# Altium project LimeSDR-QPCIe_1v2.PrjPcb (part 1 of 13)
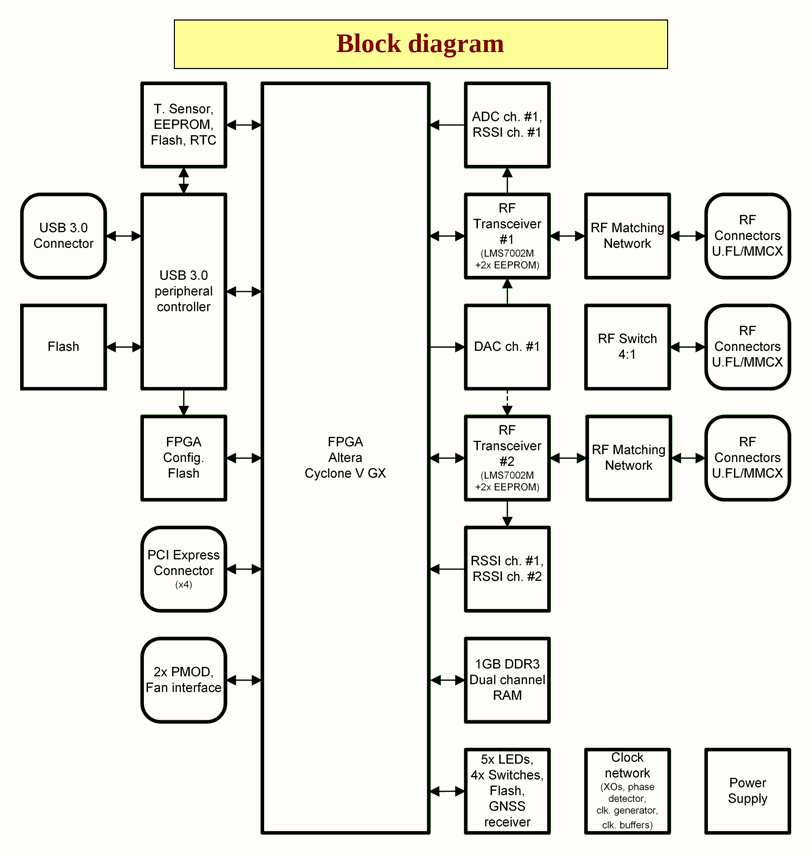
[diagram p0: 01_BlockDiagram.SchDoc]
29 sheets, 2027 parts. Net scope: global (net labels, ports and power ports of the same name join across sheets).
Board file: LimeSDR-QPCIe_1v2.PcbDoc
Sheets:
  01_BlockDiagram.SchDoc
  02_PowerDiagram.SchDoc
  03_ClockDiagram.SchDoc
  04_LMS7002M_Digital.SchDoc
  05_LMS7002M_1_RF.SchDoc
  06_LMS7002M_2_RF.SchDoc
  07_LMS7002M_1_Power.SchDoc
  08_LMS7002M_2_Power.SchDoc
  09_RF_Loopback.SchDoc
  10_RSSI1.SchDoc
  11_RSSI2.SchDoc
  12_FPGA_banks_3A_3B_4A.SchDoc
  13_FPGA_banks_5A_5B_6A.SchDoc
  14_FPGA_banks_7A_8A.SchDoc
  15_FPGA_misc_banks.SchDoc
  16_FPGA_pwr_banks.SchDoc
  17_FPGA_decoupling.SchDoc
  18_DDR3_TOP.SchDoc
  19_DDR3_BOT.SchDoc
  20_ADC.SchDoc
  21_DAC.SchDoc
  22_USB3_0_device.SchDoc
  23_PCIe.SchDoc
  24_Peripherals.SchDoc
  25_Clocks_1.SchDoc
  26_Clocks_2.SchDoc
  27_BoardPowerSupply 1.SchDoc
  28_BoardPowerSupply 2.SchDoc
  29_LMS7002M_PowerSupply.SchDoc

## Sheet 01_BlockDiagram.SchDoc: Block diagram
size A4; Organization: Lime Microsystems; Address1: Surrey Tech Centre; Address2: Guildford GU2 7YG; Address3: Surrey; Address4: United Kingdom; Revision: v1.2; SheetNumber: 1; SheetTotal: 27

### Notes on the sheet
- Block diagram
- Project name:
- Title:
- Size:
- Date:
- A4
- Revision:
- Time:
- Sheet
- of
- File:

## Sheet 02_PowerDiagram.SchDoc: Power diagram
size A4; Organization: Lime Microsystems; Address1: Surrey Tech Centre; Address2: Guildford GU2 7YG; Address3: Surrey; Address4: United Kingdom; Revision: v1.2; SheetNumber: 2; SheetTotal: 27
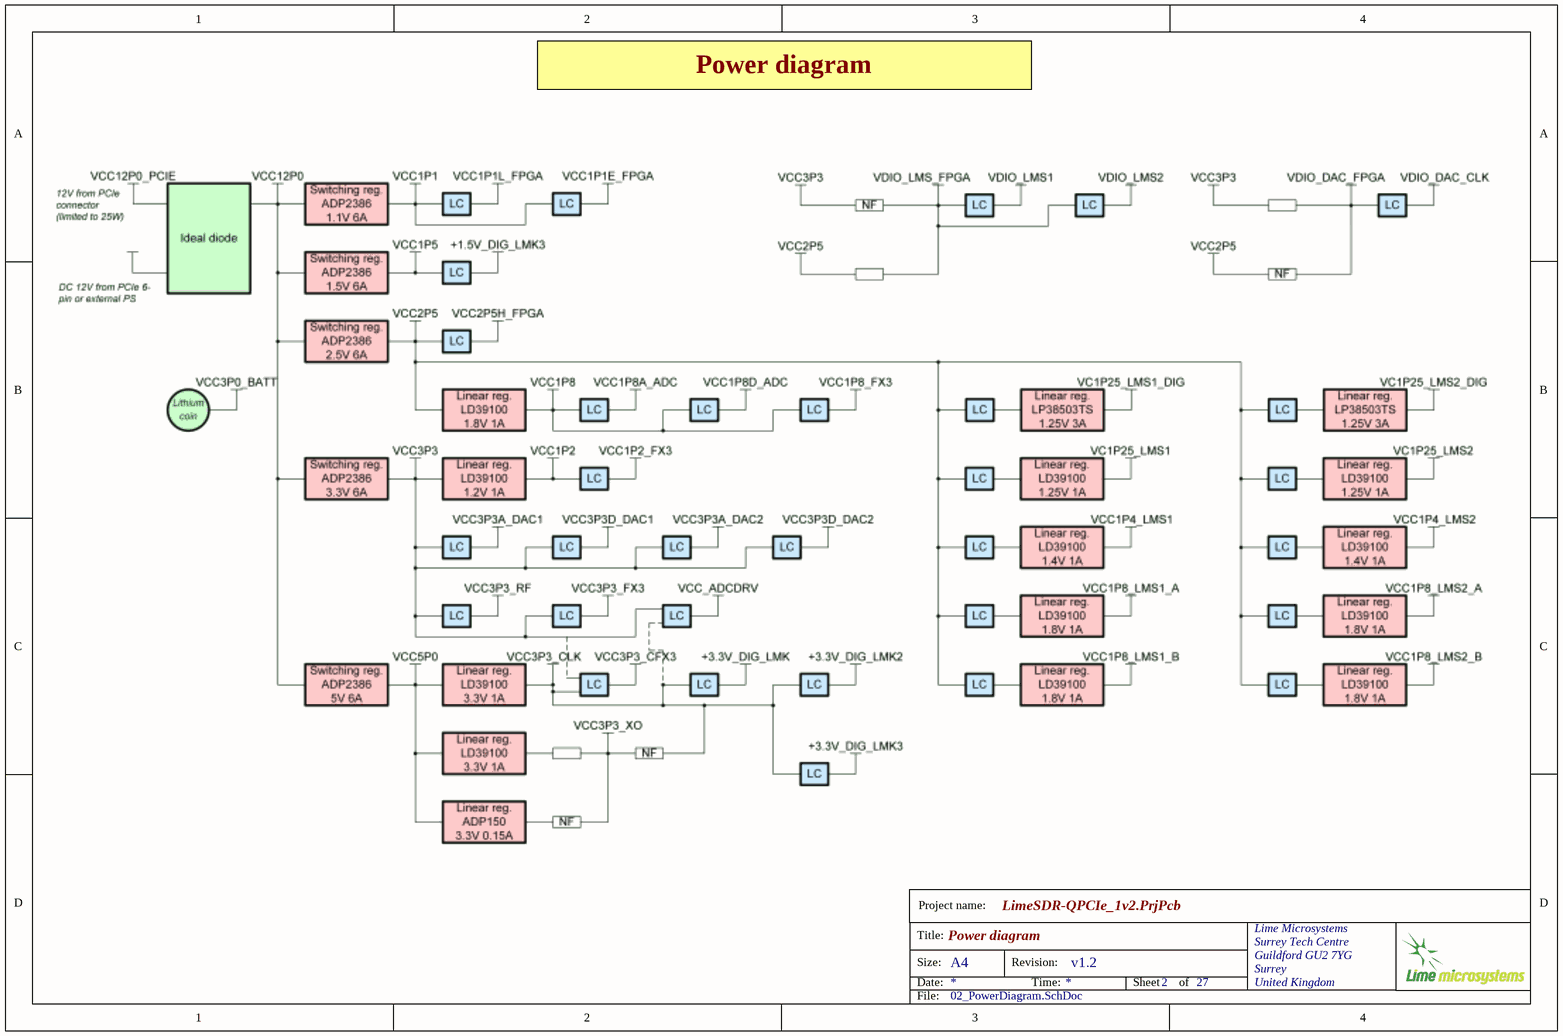
[diagram p1: 02_PowerDiagram.SchDoc]

### Notes on the sheet
- Power diagram
- Project name:
- Title:
- Size:
- Date:
- A4
- Revision:
- Time:
- Sheet
- of
- File:

## Sheet 03_ClockDiagram.SchDoc: Clock diagram
size A4; Organization: Lime Microsystems; Address1: Surrey Tech Centre; Address2: Guildford GU2 7YG; Address3: Surrey; Address4: United Kingdom; Revision: v1.2; SheetNumber: 3; SheetTotal: 27
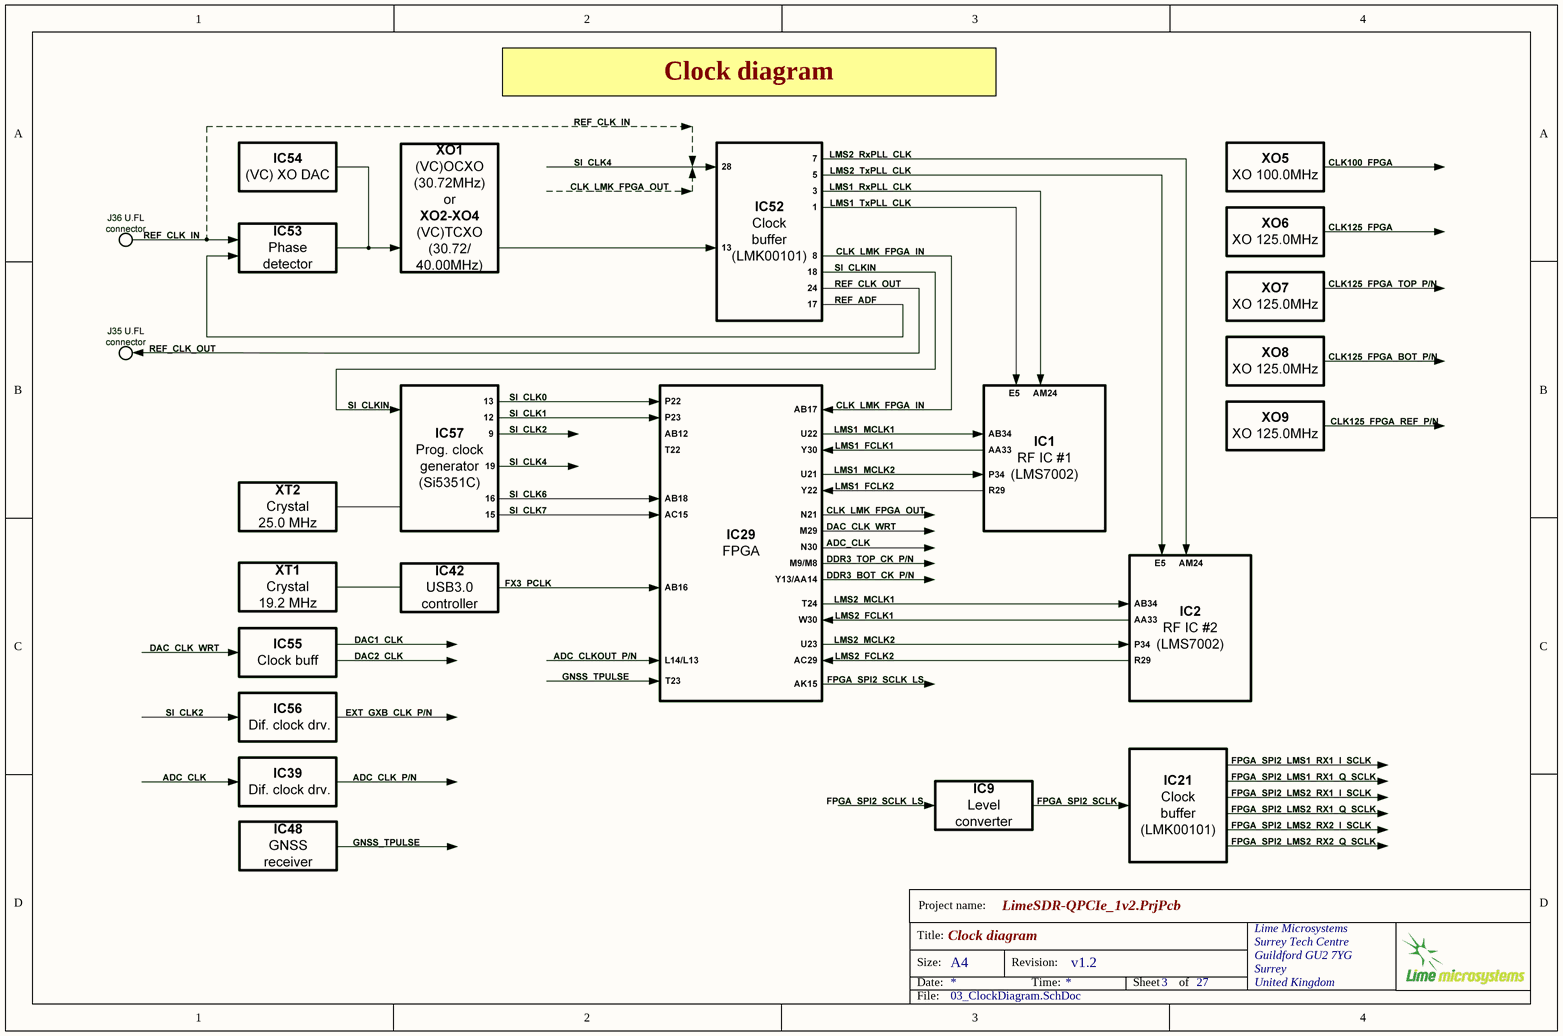
[diagram p2: 03_ClockDiagram.SchDoc]

### Notes on the sheet
- Clock diagram
- Project name:
- Title:
- Size:
- Date:
- A4
- Revision:
- Time:
- Sheet
- of
- File:

## Sheet 04_LMS7002M_Digital.SchDoc: LMS7002M #1 digital circuit
size A3; Organization: Lime Microsystems; Address1: Surrey Tech Centre; Address2: Guildford GU2 7YG; Address3: Surrey; Address4: United Kingdom; Revision: v1.2; SheetNumber: 4; SheetTotal: 27
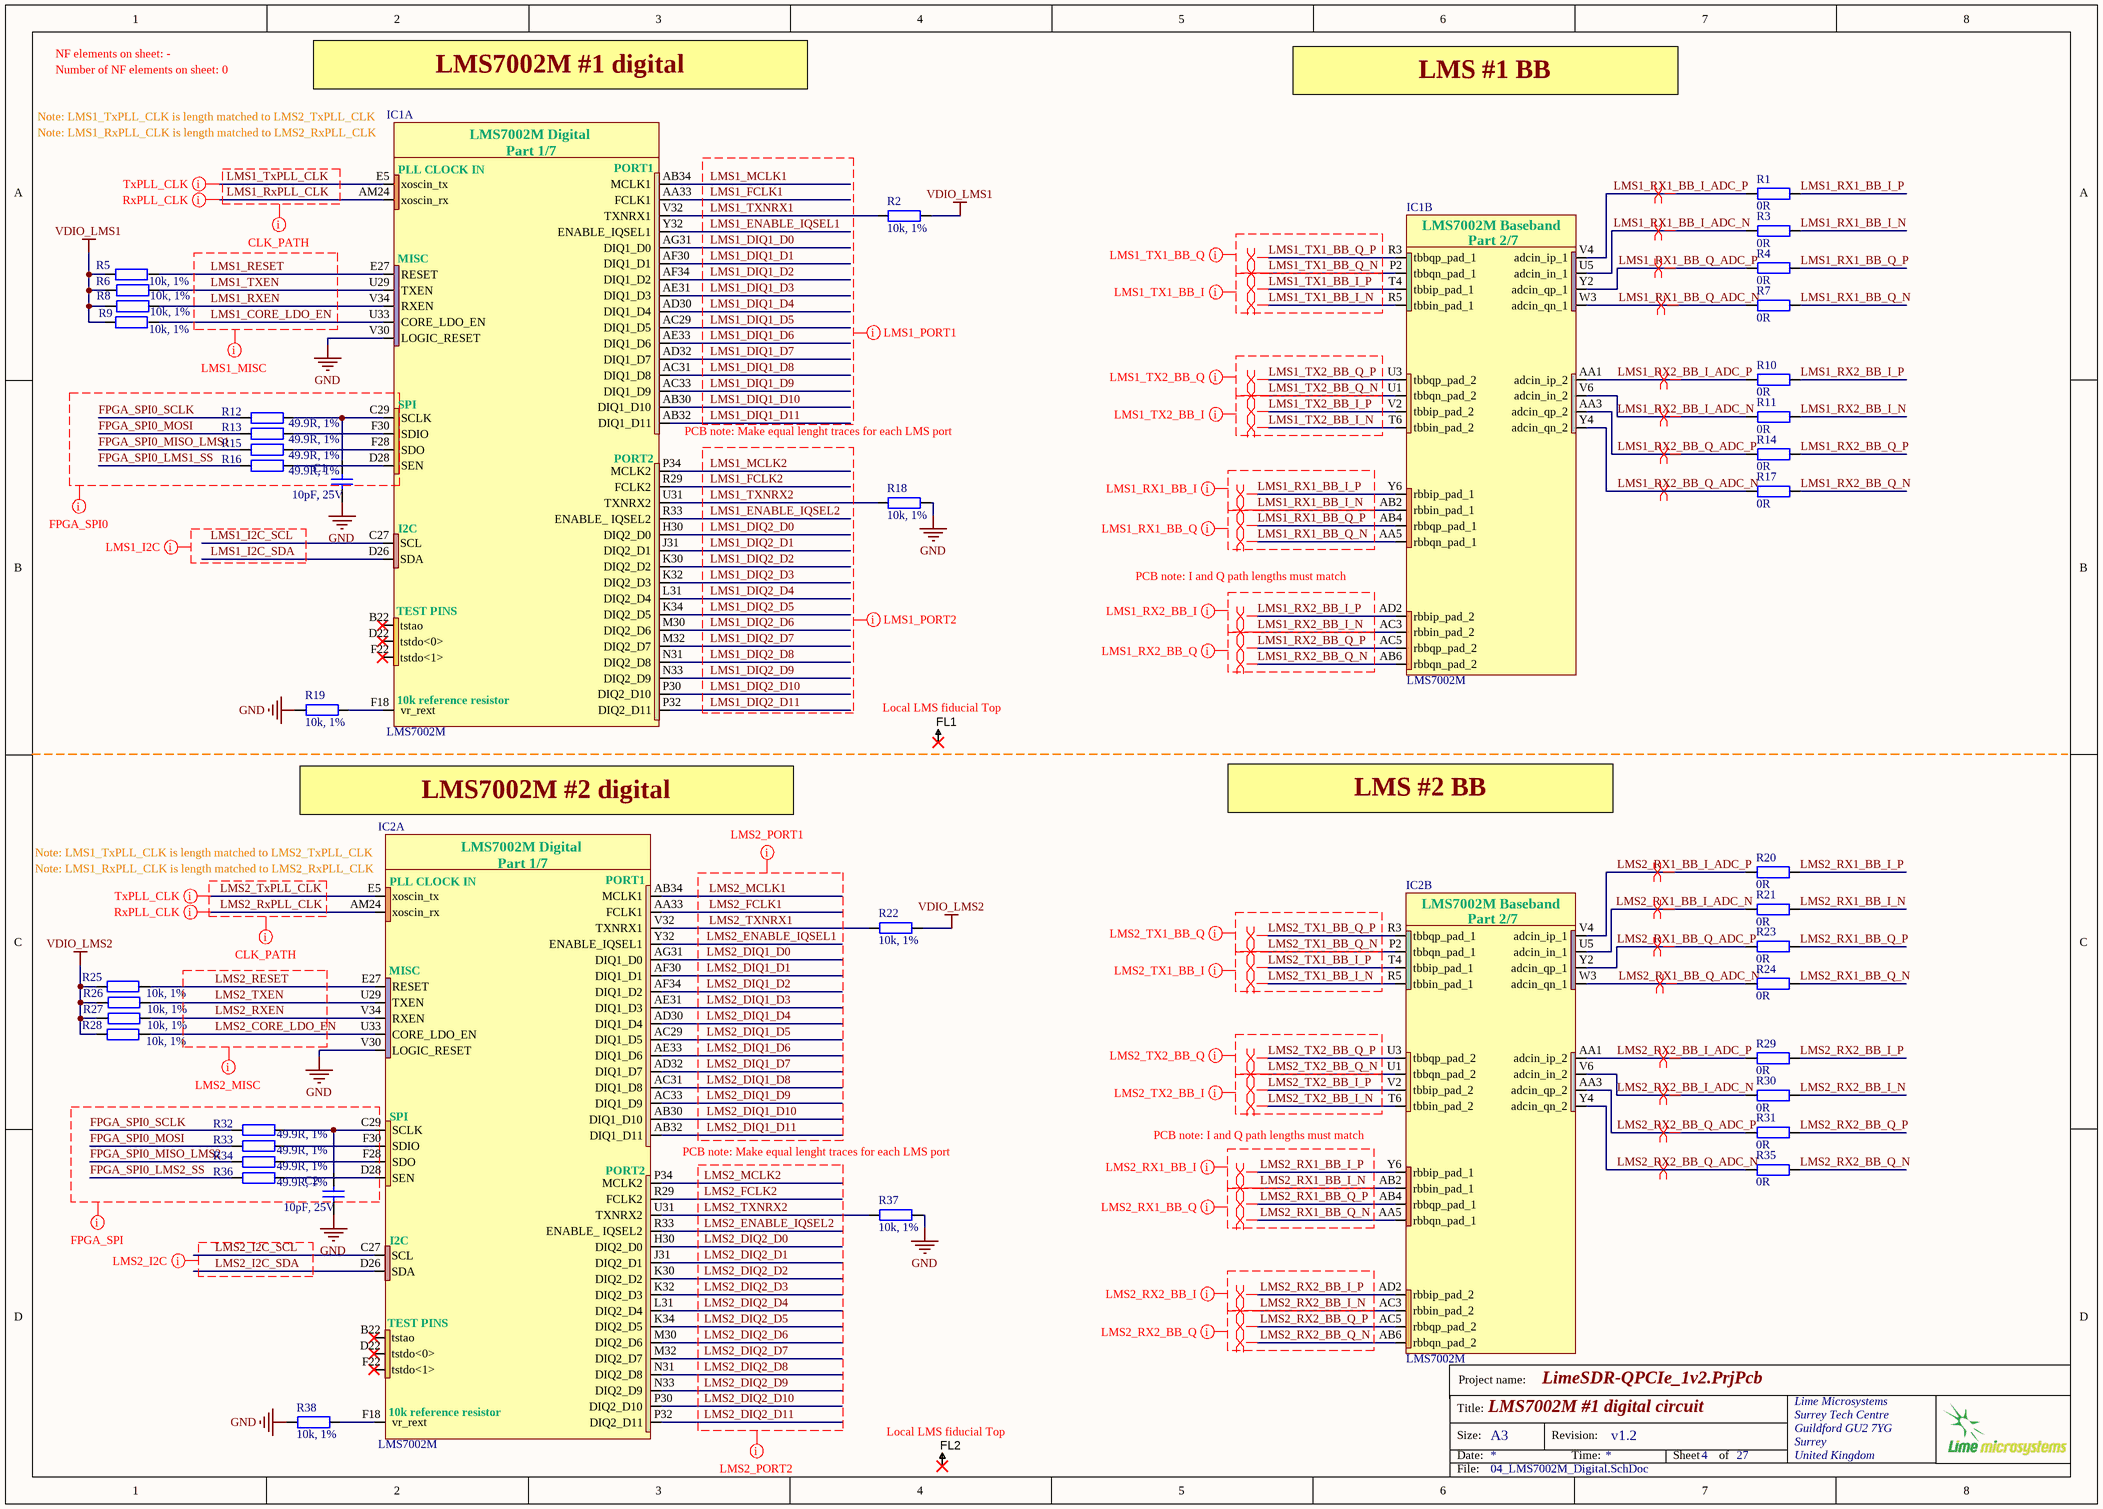
[diagram p3: 04_LMS7002M_Digital.SchDoc]

### Parts
C1  10pF, 25V  [CAP0402]
C2  10pF, 25V  [CAP0402]
FL1  Fiducial  [Fiducial_local]  (value not drawn)
FL2  Fiducial  [Fiducial_local]  (value not drawn)
IC1  LMS7002M  [LMS7002M_v4]  (parts A,B of 7)
IC2  LMS7002M  [LMS7002M_v4]  (parts A,B of 7)
R1  0R  [RES0402]
R2  10k, 1%  [RES0402]
R3  0R  [RES0402]
R4  0R  [RES0402]
R5  10k, 1%  [RES0402]
R6  10k, 1%  [RES0402]
R7  0R  [RES0402]
R8  10k, 1%  [RES0402]
R9  10k, 1%  [RES0402]
R10  0R  [RES0402]
R11  0R  [RES0402]
R12  49.9R, 1%  [RES0402]
R13  49.9R, 1%  [RES0402]
R14  0R  [RES0402]
R15  49.9R, 1%  [RES0402]
R16  49.9R, 1%  [RES0402]
R17  0R  [RES0402]
R18  10k, 1%  [RES0402]
R19  10k, 1%  [RES0402]
R20  0R  [RES0402]
R21  0R  [RES0402]
R22  10k, 1%  [RES0402]
R23  0R  [RES0402]
R24  0R  [RES0402]
R25  10k, 1%  [RES0402]
R26  10k, 1%  [RES0402]
R27  10k, 1%  [RES0402]
R28  10k, 1%  [RES0402]
R29  0R  [RES0402]
R30  0R  [RES0402]
R31  0R  [RES0402]
R32  49.9R, 1%  [RES0402]
R33  49.9R, 1%  [RES0402]
R34  49.9R, 1%  [RES0402]
R35  0R  [RES0402]
R36  49.9R, 1%  [RES0402]
R37  10k, 1%  [RES0402]
R38  10k, 1%  [RES0402]

### Nets
GND: C1.2 C2.2 IC1.V30(LOGIC_RESET) IC2.V30(LOGIC_RESET) R18.2 R19.2 R37.2 R38.2
VDIO_LMS1: R2.2 R5.1 R6.2 R8.2 R9.1
VDIO_LMS2: R22.2 R25.1 R26.2 R27.2 R28.1
FPGA_SPI0_LMS1_SS: R16.2
FPGA_SPI0_LMS2_SS: R36.2
FPGA_SPI0_MISO_LMS1: R15.2
FPGA_SPI0_MISO_LMS2: R34.2
FPGA_SPI0_MOSI: R13.2 R33.2
FPGA_SPI0_SCLK: R12.2 R32.2
LMS1_CORE_LDO_EN: IC1.U33(CORE_LDO_EN) R9.2
LMS1_DIQ1_D0: IC1.AG31(DIQ1_D0)
LMS1_DIQ1_D1: IC1.AF30(DIQ1_D1)
LMS1_DIQ1_D2: IC1.AF34(DIQ1_D2)
LMS1_DIQ1_D3: IC1.AE31(DIQ1_D3)
LMS1_DIQ1_D4: IC1.AD30(DIQ1_D4)
LMS1_DIQ1_D5: IC1.AC29(DIQ1_D5)
LMS1_DIQ1_D6: IC1.AE33(DIQ1_D6)
LMS1_DIQ1_D7: IC1.AD32(DIQ1_D7)
LMS1_DIQ1_D8: IC1.AC31(DIQ1_D8)
LMS1_DIQ1_D9: IC1.AC33(DIQ1_D9)
LMS1_DIQ1_D10: IC1.AB30(DIQ1_D10)
LMS1_DIQ1_D11: IC1.AB32(DIQ1_D11)
LMS1_DIQ2_D0: IC1.H30(DIQ2_D0)
LMS1_DIQ2_D1: IC1.J31(DIQ2_D1)
LMS1_DIQ2_D2: IC1.K30(DIQ2_D2)
LMS1_DIQ2_D3: IC1.K32(DIQ2_D3)
LMS1_DIQ2_D4: IC1.L31(DIQ2_D4)
LMS1_DIQ2_D5: IC1.K34(DIQ2_D5)
LMS1_DIQ2_D6: IC1.M30(DIQ2_D6)
LMS1_DIQ2_D7: IC1.M32(DIQ2_D7)
LMS1_DIQ2_D8: IC1.N31(DIQ2_D8)
LMS1_DIQ2_D9: IC1.N33(DIQ2_D9)
LMS1_DIQ2_D10: IC1.P30(DIQ2_D10)
LMS1_DIQ2_D11: IC1.P32(DIQ2_D11)
LMS1_ENABLE_IQSEL1: IC1.Y32(ENABLE_IQSEL1)
LMS1_ENABLE_IQSEL2: IC1.R33(ENABLE__IQSEL2)
LMS1_FCLK1: IC1.AA33(FCLK1)
LMS1_FCLK2: IC1.R29(FCLK2)
LMS1_I2C_SCL: IC1.C27(SCL)
LMS1_I2C_SDA: IC1.D26(SDA)
LMS1_MCLK1: IC1.AB34(MCLK1)
LMS1_MCLK2: IC1.P34(MCLK2)
LMS1_RESET: IC1.E27(RESET) R5.2
LMS1_RX1_BB_I_ADC_N: IC1.U5(adcin_in_1) R3.2
LMS1_RX1_BB_I_ADC_P: IC1.V4(adcin_ip_1) R1.2
LMS1_RX1_BB_I_N: IC1.AB2(rbbin_pad_1) R3.1
LMS1_RX1_BB_I_P: IC1.Y6(rbbip_pad_1) R1.1
LMS1_RX1_BB_Q_ADC_N: IC1.W3(adcin_qn_1) R7.2
LMS1_RX1_BB_Q_ADC_P: IC1.Y2(adcin_qp_1) R4.2
LMS1_RX1_BB_Q_N: IC1.AA5(rbbqn_pad_1) R7.1
LMS1_RX1_BB_Q_P: IC1.AB4(rbbqp_pad_1) R4.1
LMS1_RX2_BB_I_ADC_N: IC1.V6(adcin_in_2) R11.2
LMS1_RX2_BB_I_ADC_P: IC1.AA1(adcin_ip_2) R10.2
LMS1_RX2_BB_I_N: IC1.AC3(rbbin_pad_2) R11.1
LMS1_RX2_BB_I_P: IC1.AD2(rbbip_pad_2) R10.1
LMS1_RX2_BB_Q_ADC_N: IC1.Y4(adcin_qn_2) R17.2
LMS1_RX2_BB_Q_ADC_P: IC1.AA3(adcin_qp_2) R14.2
LMS1_RX2_BB_Q_N: IC1.AB6(rbbqn_pad_2) R17.1
LMS1_RX2_BB_Q_P: IC1.AC5(rbbqp_pad_2) R14.1
LMS1_RXEN: IC1.V34(RXEN) R6.1
LMS1_RxPLL_CLK: IC1.AM24(xoscin_rx)
LMS1_TX1_BB_I_N: IC1.R5(tbbin_pad_1)
LMS1_TX1_BB_I_P: IC1.T4(tbbip_pad_1)
LMS1_TX1_BB_Q_N: IC1.P2(tbbqn_pad_1)
LMS1_TX1_BB_Q_P: IC1.R3(tbbqp_pad_1)
LMS1_TX2_BB_I_N: IC1.T6(tbbin_pad_2)
LMS1_TX2_BB_I_P: IC1.V2(tbbip_pad_2)
LMS1_TX2_BB_Q_N: IC1.U1(tbbqn_pad_2)
LMS1_TX2_BB_Q_P: IC1.U3(tbbqp_pad_2)
LMS1_TXEN: IC1.U29(TXEN) R8.1
LMS1_TXNRX1: IC1.V32(TXNRX1) R2.1
LMS1_TXNRX2: IC1.U31(TXNRX2) R18.1
LMS1_TxPLL_CLK: IC1.E5(xoscin_tx)
LMS2_CORE_LDO_EN: IC2.U33(CORE_LDO_EN) R28.2
LMS2_DIQ1_D0: IC2.AG31(DIQ1_D0)
LMS2_DIQ1_D1: IC2.AF30(DIQ1_D1)
LMS2_DIQ1_D2: IC2.AF34(DIQ1_D2)
LMS2_DIQ1_D3: IC2.AE31(DIQ1_D3)
LMS2_DIQ1_D4: IC2.AD30(DIQ1_D4)
LMS2_DIQ1_D5: IC2.AC29(DIQ1_D5)
LMS2_DIQ1_D6: IC2.AE33(DIQ1_D6)
LMS2_DIQ1_D7: IC2.AD32(DIQ1_D7)
LMS2_DIQ1_D8: IC2.AC31(DIQ1_D8)
LMS2_DIQ1_D9: IC2.AC33(DIQ1_D9)
LMS2_DIQ1_D10: IC2.AB30(DIQ1_D10)
LMS2_DIQ1_D11: IC2.AB32(DIQ1_D11)
LMS2_DIQ2_D0: IC2.H30(DIQ2_D0)
LMS2_DIQ2_D1: IC2.J31(DIQ2_D1)
LMS2_DIQ2_D2: IC2.K30(DIQ2_D2)
LMS2_DIQ2_D3: IC2.K32(DIQ2_D3)
LMS2_DIQ2_D4: IC2.L31(DIQ2_D4)
LMS2_DIQ2_D5: IC2.K34(DIQ2_D5)
LMS2_DIQ2_D6: IC2.M30(DIQ2_D6)
LMS2_DIQ2_D7: IC2.M32(DIQ2_D7)
LMS2_DIQ2_D8: IC2.N31(DIQ2_D8)
LMS2_DIQ2_D9: IC2.N33(DIQ2_D9)
LMS2_DIQ2_D10: IC2.P30(DIQ2_D10)
LMS2_DIQ2_D11: IC2.P32(DIQ2_D11)
LMS2_ENABLE_IQSEL1: IC2.Y32(ENABLE_IQSEL1)
LMS2_ENABLE_IQSEL2: IC2.R33(ENABLE__IQSEL2)
LMS2_FCLK1: IC2.AA33(FCLK1)
LMS2_FCLK2: IC2.R29(FCLK2)
LMS2_I2C_SCL: IC2.C27(SCL)
LMS2_I2C_SDA: IC2.D26(SDA)
LMS2_MCLK1: IC2.AB34(MCLK1)
LMS2_MCLK2: IC2.P34(MCLK2)
LMS2_RESET: IC2.E27(RESET) R25.2
LMS2_RX1_BB_I_ADC_N: IC2.U5(adcin_in_1) R21.2
LMS2_RX1_BB_I_ADC_P: IC2.V4(adcin_ip_1) R20.2
LMS2_RX1_BB_I_N: IC2.AB2(rbbin_pad_1) R21.1
LMS2_RX1_BB_I_P: IC2.Y6(rbbip_pad_1) R20.1
LMS2_RX1_BB_Q_ADC_N: IC2.W3(adcin_qn_1) R24.2
LMS2_RX1_BB_Q_ADC_P: IC2.Y2(adcin_qp_1) R23.2
LMS2_RX1_BB_Q_N: IC2.AA5(rbbqn_pad_1) R24.1
LMS2_RX1_BB_Q_P: IC2.AB4(rbbqp_pad_1) R23.1
LMS2_RX2_BB_I_ADC_N: IC2.V6(adcin_in_2) R30.2
LMS2_RX2_BB_I_ADC_P: IC2.AA1(adcin_ip_2) R29.2
LMS2_RX2_BB_I_N: IC2.AC3(rbbin_pad_2) R30.1
LMS2_RX2_BB_I_P: IC2.AD2(rbbip_pad_2) R29.1
LMS2_RX2_BB_Q_ADC_N: IC2.Y4(adcin_qn_2) R35.2
LMS2_RX2_BB_Q_ADC_P: IC2.AA3(adcin_qp_2) R31.2
LMS2_RX2_BB_Q_N: IC2.AB6(rbbqn_pad_2) R35.1
LMS2_RX2_BB_Q_P: IC2.AC5(rbbqp_pad_2) R31.1
LMS2_RXEN: IC2.V34(RXEN) R27.1
LMS2_RxPLL_CLK: IC2.AM24(xoscin_rx)
LMS2_TX1_BB_I_N: IC2.R5(tbbin_pad_1)
LMS2_TX1_BB_I_P: IC2.T4(tbbip_pad_1)
LMS2_TX1_BB_Q_N: IC2.P2(tbbqn_pad_1)
LMS2_TX1_BB_Q_P: IC2.R3(tbbqp_pad_1)
LMS2_TX2_BB_I_N: IC2.T6(tbbin_pad_2)
LMS2_TX2_BB_I_P: IC2.V2(tbbip_pad_2)
LMS2_TX2_BB_Q_N: IC2.U1(tbbqn_pad_2)
LMS2_TX2_BB_Q_P: IC2.U3(tbbqp_pad_2)
LMS2_TXEN: IC2.U29(TXEN) R26.1
LMS2_TXNRX1: IC2.V32(TXNRX1) R22.1
LMS2_TXNRX2: IC2.U31(TXNRX2) R37.1
LMS2_TxPLL_CLK: IC2.E5(xoscin_tx)
NetC1_1: C1.1 IC1.C29(SCLK) R12.1
NetC2_1: C2.1 IC2.C29(SCLK) R32.1
NetIC1_D28: IC1.D28(SEN) R16.1
NetIC1_F18: IC1.F18(vr_rext) R19.1
NetIC1_F28: IC1.F28(SDO) R15.1
NetIC1_F30: IC1.F30(SDIO) R13.1
NetIC2_D28: IC2.D28(SEN) R36.1
NetIC2_F18: IC2.F18(vr_rext) R38.1
NetIC2_F28: IC2.F28(SDO) R34.1
NetIC2_F30: IC2.F30(SDIO) R33.1

Not connected (* = marked no-connect by the designer): FL1 1*; FL2 1*; IC1 B22(tstao)* D22(tstdo<0>)* F22(tstdo<1>)*; IC2 B22(tstao)* D22(tstdo<0>)* F22(tstdo<1>)*

### Layout directives
differential pair: LMS1_RX1_BB_I_ADC_N, LMS1_RX1_BB_I_ADC_P, LMS1_RX1_BB_I_N, LMS1_RX1_BB_I_P, LMS1_RX1_BB_Q_ADC_N, LMS1_RX1_BB_Q_ADC_P, LMS1_RX1_BB_Q_N, LMS1_RX1_BB_Q_P, LMS1_RX2_BB_I_ADC_N, LMS1_RX2_BB_I_ADC_P, LMS1_RX2_BB_I_N, LMS1_RX2_BB_I_P, LMS1_RX2_BB_Q_ADC_N, LMS1_RX2_BB_Q_ADC_P, LMS1_RX2_BB_Q_N, LMS1_RX2_BB_Q_P, LMS1_TX1_BB_I_N, LMS1_TX1_BB_I_P, LMS1_TX1_BB_Q_N, LMS1_TX1_BB_Q_P, LMS1_TX2_BB_I_N, LMS1_TX2_BB_I_P, LMS1_TX2_BB_Q_N, LMS1_TX2_BB_Q_P, LMS2_RX1_BB_I_ADC_N, LMS2_RX1_BB_I_ADC_P, LMS2_RX1_BB_I_N, LMS2_RX1_BB_I_P, LMS2_RX1_BB_Q_ADC_N, LMS2_RX1_BB_Q_ADC_P, LMS2_RX1_BB_Q_N, LMS2_RX1_BB_Q_P, LMS2_RX2_BB_I_ADC_N, LMS2_RX2_BB_I_ADC_P, LMS2_RX2_BB_I_N, LMS2_RX2_BB_I_P, LMS2_RX2_BB_Q_ADC_N, LMS2_RX2_BB_Q_ADC_P, LMS2_RX2_BB_Q_N, LMS2_RX2_BB_Q_P, LMS2_TX1_BB_I_N, LMS2_TX1_BB_I_P, LMS2_TX1_BB_Q_N, LMS2_TX1_BB_Q_P, LMS2_TX2_BB_I_N, LMS2_TX2_BB_I_P, LMS2_TX2_BB_Q_N, LMS2_TX2_BB_Q_P
net class LMS1_RX1_BB_I: LMS1_RX1_BB_I_N, LMS1_RX1_BB_I_P
net class LMS1_RX1_BB_Q: LMS1_RX1_BB_I_N, LMS1_RX1_BB_Q_N, LMS1_RX1_BB_Q_P
net class LMS1_TX1_BB_Q: LMS1_TX1_BB_Q_N, LMS1_TX1_BB_Q_P
net class LMS1_TX1_BB_I: LMS1_TX1_BB_I_N, LMS1_TX1_BB_I_P, LMS1_TX1_BB_Q_N
net class LMS1_TX2_BB_Q: LMS1_TX2_BB_Q_N, LMS1_TX2_BB_Q_P
net class LMS1_TX2_BB_I: LMS1_TX2_BB_I_N, LMS1_TX2_BB_I_P, LMS1_TX2_BB_Q_N
net class FPGA_SPI0: FPGA_SPI0_LMS1_SS, FPGA_SPI0_MISO_LMS1, FPGA_SPI0_MOSI, FPGA_SPI0_SCLK
net class LMS1_I2C: LMS1_I2C_SCL, LMS1_I2C_SDA
net class LMS1_PORT2: LMS1_DIQ2_D0, LMS1_DIQ2_D1, LMS1_DIQ2_D2, LMS1_DIQ2_D3, LMS1_DIQ2_D4, LMS1_DIQ2_D5, LMS1_DIQ2_D6, LMS1_DIQ2_D7, LMS1_DIQ2_D8, LMS1_DIQ2_D9, LMS1_DIQ2_D10, LMS1_DIQ2_D11, LMS1_ENABLE_IQSEL2, LMS1_FCLK2, LMS1_MCLK2, LMS1_TXNRX2
net class LMS1_PORT1: LMS1_DIQ1_D0, LMS1_DIQ1_D1, LMS1_DIQ1_D2, LMS1_DIQ1_D3, LMS1_DIQ1_D4, LMS1_DIQ1_D5, LMS1_DIQ1_D6, LMS1_DIQ1_D7, LMS1_DIQ1_D8, LMS1_DIQ1_D9, LMS1_DIQ1_D10, LMS1_DIQ1_D11, LMS1_ENABLE_IQSEL1, LMS1_FCLK1, LMS1_MCLK1, LMS1_TXNRX1
net class LMS1_MISC: LMS1_CORE_LDO_EN, LMS1_RESET, LMS1_RXEN, LMS1_TXEN
net class CLK_PATH: LMS1_RxPLL_CLK, LMS1_TxPLL_CLK, LMS2_RxPLL_CLK, LMS2_TxPLL_CLK
net class FPGA_SPI: FPGA_SPI0_LMS2_SS, FPGA_SPI0_MISO_LMS2, FPGA_SPI0_MOSI, FPGA_SPI0_SCLK
net class LMS2_I2C: LMS2_I2C_SCL, LMS2_I2C_SDA
net class LMS2_PORT2: LMS2_DIQ2_D0, LMS2_DIQ2_D1, LMS2_DIQ2_D2, LMS2_DIQ2_D3, LMS2_DIQ2_D4, LMS2_DIQ2_D5, LMS2_DIQ2_D6, LMS2_DIQ2_D7, LMS2_DIQ2_D8, LMS2_DIQ2_D9, LMS2_DIQ2_D10, LMS2_DIQ2_D11, LMS2_ENABLE_IQSEL2, LMS2_FCLK2, LMS2_MCLK2, LMS2_TXNRX2
net class LMS2_PORT1: LMS2_DIQ1_D0, LMS2_DIQ1_D1, LMS2_DIQ1_D2, LMS2_DIQ1_D3, LMS2_DIQ1_D4, LMS2_DIQ1_D5, LMS2_DIQ1_D6, LMS2_DIQ1_D7, LMS2_DIQ1_D8, LMS2_DIQ1_D9, LMS2_DIQ1_D10, LMS2_DIQ1_D11, LMS2_ENABLE_IQSEL1, LMS2_FCLK1, LMS2_MCLK1, LMS2_TXNRX1
net class LMS2_TX1_BB_Q: LMS2_TX1_BB_Q_N, LMS2_TX1_BB_Q_P
net class LMS2_TX1_BB_I: LMS2_TX1_BB_I_N, LMS2_TX1_BB_I_P, LMS2_TX1_BB_Q_N
net class LMS2_TX2_BB_Q: LMS2_TX2_BB_Q_N, LMS2_TX2_BB_Q_P
net class LMS2_TX2_BB_I: LMS2_TX2_BB_I_N, LMS2_TX2_BB_I_P, LMS2_TX2_BB_Q_N
net class LMS2_MISC: LMS2_CORE_LDO_EN, LMS2_RESET, LMS2_RXEN, LMS2_TXEN
net class LMS2_RX1_BB_I: LMS2_RX1_BB_I_N, LMS2_RX1_BB_I_P
net class LMS2_RX1_BB_Q: LMS2_RX1_BB_I_N, LMS2_RX1_BB_Q_N, LMS2_RX1_BB_Q_P
net class LMS2_RX2_BB_I: LMS2_RX2_BB_I_P
net class LMS2_RX2_BB_Q: LMS2_RX2_BB_I_N, LMS2_RX2_BB_Q_N, LMS2_RX2_BB_Q_P
net class LMS1_RX2_BB_I: LMS1_RX2_BB_I_N, LMS1_RX2_BB_I_P
net class LMS1_RX2_BB_Q: LMS1_RX2_BB_I_N, LMS1_RX2_BB_Q_N, LMS1_RX2_BB_Q_P
net class RxPLL_CLK: LMS1_RxPLL_CLK, LMS2_RxPLL_CLK
net class TxPLL_CLK: LMS1_TxPLL_CLK, LMS2_TxPLL_CLK

### Notes on the sheet
- NF elements on sheet: -
- Number of NF elements on sheet: 0
- LMS7002M #1 digital
- LMS #1 BB
- Note: LMS1_TxPLL_CLK is length matched to LMS2_TxPLL_CLK
- (near IC1) Note: LMS1_RxPLL_CLK is length matched to LMS2_RxPLL_CLK
- (near IC1) PCB note: Make equal lenght traces for each LMS port
- (near IC1) PCB note: I and Q path lengths must match
- (near FL1) Local LMS fiducial Top
- (near IC2) Note: LMS1_TxPLL_CLK is length matched to LMS2_TxPLL_CLK
- LMS7002M #2 digital
- LMS #2 BB
- (near IC2) Note: LMS1_RxPLL_CLK is length matched to LMS2_RxPLL_CLK
- (near IC2) PCB note: Make equal lenght traces for each LMS port
- (near IC2) PCB note: I and Q path lengths must match
- (near FL2) Local LMS fiducial Top
- Project name:
- Title:
- Size:
- Date:
- A3
- Revision:
- Time:
- Sheet
- of
- File:
- (in symbol LMS7002Mr3, part A) LMS7002M Digital; Part 1/7; PLL CLOCK IN; PORT1; MISC; SPI; PORT2; I2C; TEST PINS; 10k reference resistor
- (in symbol LMS7002Mr3, part B) LMS7002M Baseband; Part 2/7

### Library data of the parts
C1 C2 = Cap_0402: Manufacturer Part Number 1: 04023A100JAT2A; Manufacturer: AVX; Part Description: 10pF ±5% 25V Ceramic Capacitor C0G, NP0 0402 (1005 Metric); Capacitance Tolerance: ± 5%; Voltage Rating: 25; Ceramic Capacitor Case: 0402 [1005 Metric]; Capacitor Case Style: 0402 [1005 Metric]<!--FANDB--><div class="features-and-benefits-container"></div>; Dielectric Characteristic: C0G / NP0; SVHC: No SVHC (16-Jun-2014); Capacitance: 10; Value: 10pF, 25V; Supplier 1: Farnell; Supplier Part Number 1: 2332478RL; Product Range: -; RoHS: YES; Operating Temperature Min: -55; Operating Temperature Max: 125; Capacitance Tolerance ±: ± 5%; MSL: MSL 1 - Unlimited; Packaging: Cut Tape
IC1 IC2 = LMS7002Mr3: Schematic symbol revision 3. Default footprint - 0.31mm pad; Manufacturer: Lime Microsystems; Part Description: IC FPRF Transceiver LMS7002M; 261 pin aQFN; Supplier 1: Lime Microsystems; Supplier Part Number 1: LMS7002M; Manufacturer Part Number 1: LMS7002M
R1 R3 R4 R7 R10 R11 R14 R17 R20 R21 R23 R24 R29-R31 R35 = Res_0402: Manufacturer Part Number 1: RC0402JR-070RL; Manufacturer: Yageo; Part Description: RES SMD 0.0OHM JUMPER 1/16W 0402; Resistance (Ohms): 0.0; Tolerance: Jumper; Power (Watts): 0.063W, 1/16W; Value: 0R; Supplier 1: Digi-Key; Supplier Part Number 1: 311-0.0JRTR-ND; Category: Resistors; Temperature Coefficient: -; Features: Moisture Resistant; Supplier Device Package: 0402; Height: 0.016" (0.40mm); Package / Case: 0402 (1005 Metric); Operating Temperature: -55°C ~ 155°C; Size / Dimension: 0.039" L x 0.020" W (1.00mm x 0.50mm); Composition: Thick Film; Packaging: Tape & Reel (TR); Number of Terminations: 2; RoHS: RoHS Compliant
R2 R5 R6 R8 R9 R18 R19 R22 R25-R28 R37 R38 = Res_0402: Manufacturer: Yageo; Manufacturer Part Number 1: RC0402FR-0710KL; Part Description: RES SMD 10K OHM 1% 1/16W 0402; Temperature Coefficient: ±100ppm/°C; Power (Watts): 0.063W, 1/16W; Value: 10k, 1%; Supplier 1: Digi-Key; Supplier Part Number 1: 311-10.0KLRTR-ND; Resistance (Ohms): 10k; Packaging: Tape & Reel (TR); RoHS: RoHS Compliant; Package / Case: 0402 (1005 Metric); Tolerance: ±1%; Operating Temperature: -55°C ~ 155°C; Size / Dimension: 0.039" L x 0.020" W (1.00mm x 0.50mm); Number of Terminations: 2; Category: Resistors; Height: 0.016" (0.40mm); Supplier Device Package: 0402; Features: Moisture Resistant; Composition: Thick Film
R12 R13 R15 R16 R32-R34 R36 = Res_0402: Manufacturer: Samsung Electro-Mechanics America, Inc.; Part Description: RES SMD 49.9 OHM 1% 1/16W 0402; Manufacturer Part Number 1: RC1005F49R9CS; Temperature Coefficient: ±100ppm/°C; Resistance (Ohms): 49.9; Power (Watts): 0.063W, 1/16W; Number of Terminations: 2; Size / Dimension: 0.039" L x 0.020" W (1.00mm x 0.50mm); Supplier Device Package: 0402 (1005 Metric); RoHS: RoHS Compliant; Supplier Part Number 1: 1276-3469-6-ND; Features: -; Packaging: Digi-Reel®; Tolerance: ±1%; Height: 0.016" (0.40mm); Category: Resistors; Composition: Thick Film; Package / Case: 0402 (1005 Metric); Supplier 1: Digi-Key; Operating Temperature: -55°C ~ 155°C; Value: 49.9R, 1%

## Sheet 05_LMS7002M_1_RF.SchDoc: LMS7002M #1 RF
size A3; Organization: Lime Microsystems; Address1: Surrey Tech Centre; Address2: Guildford GU2 7YG; Address3: Surrey; Address4: United Kingdom; Revision: v1.2; SheetNumber: 5; SheetTotal: 27
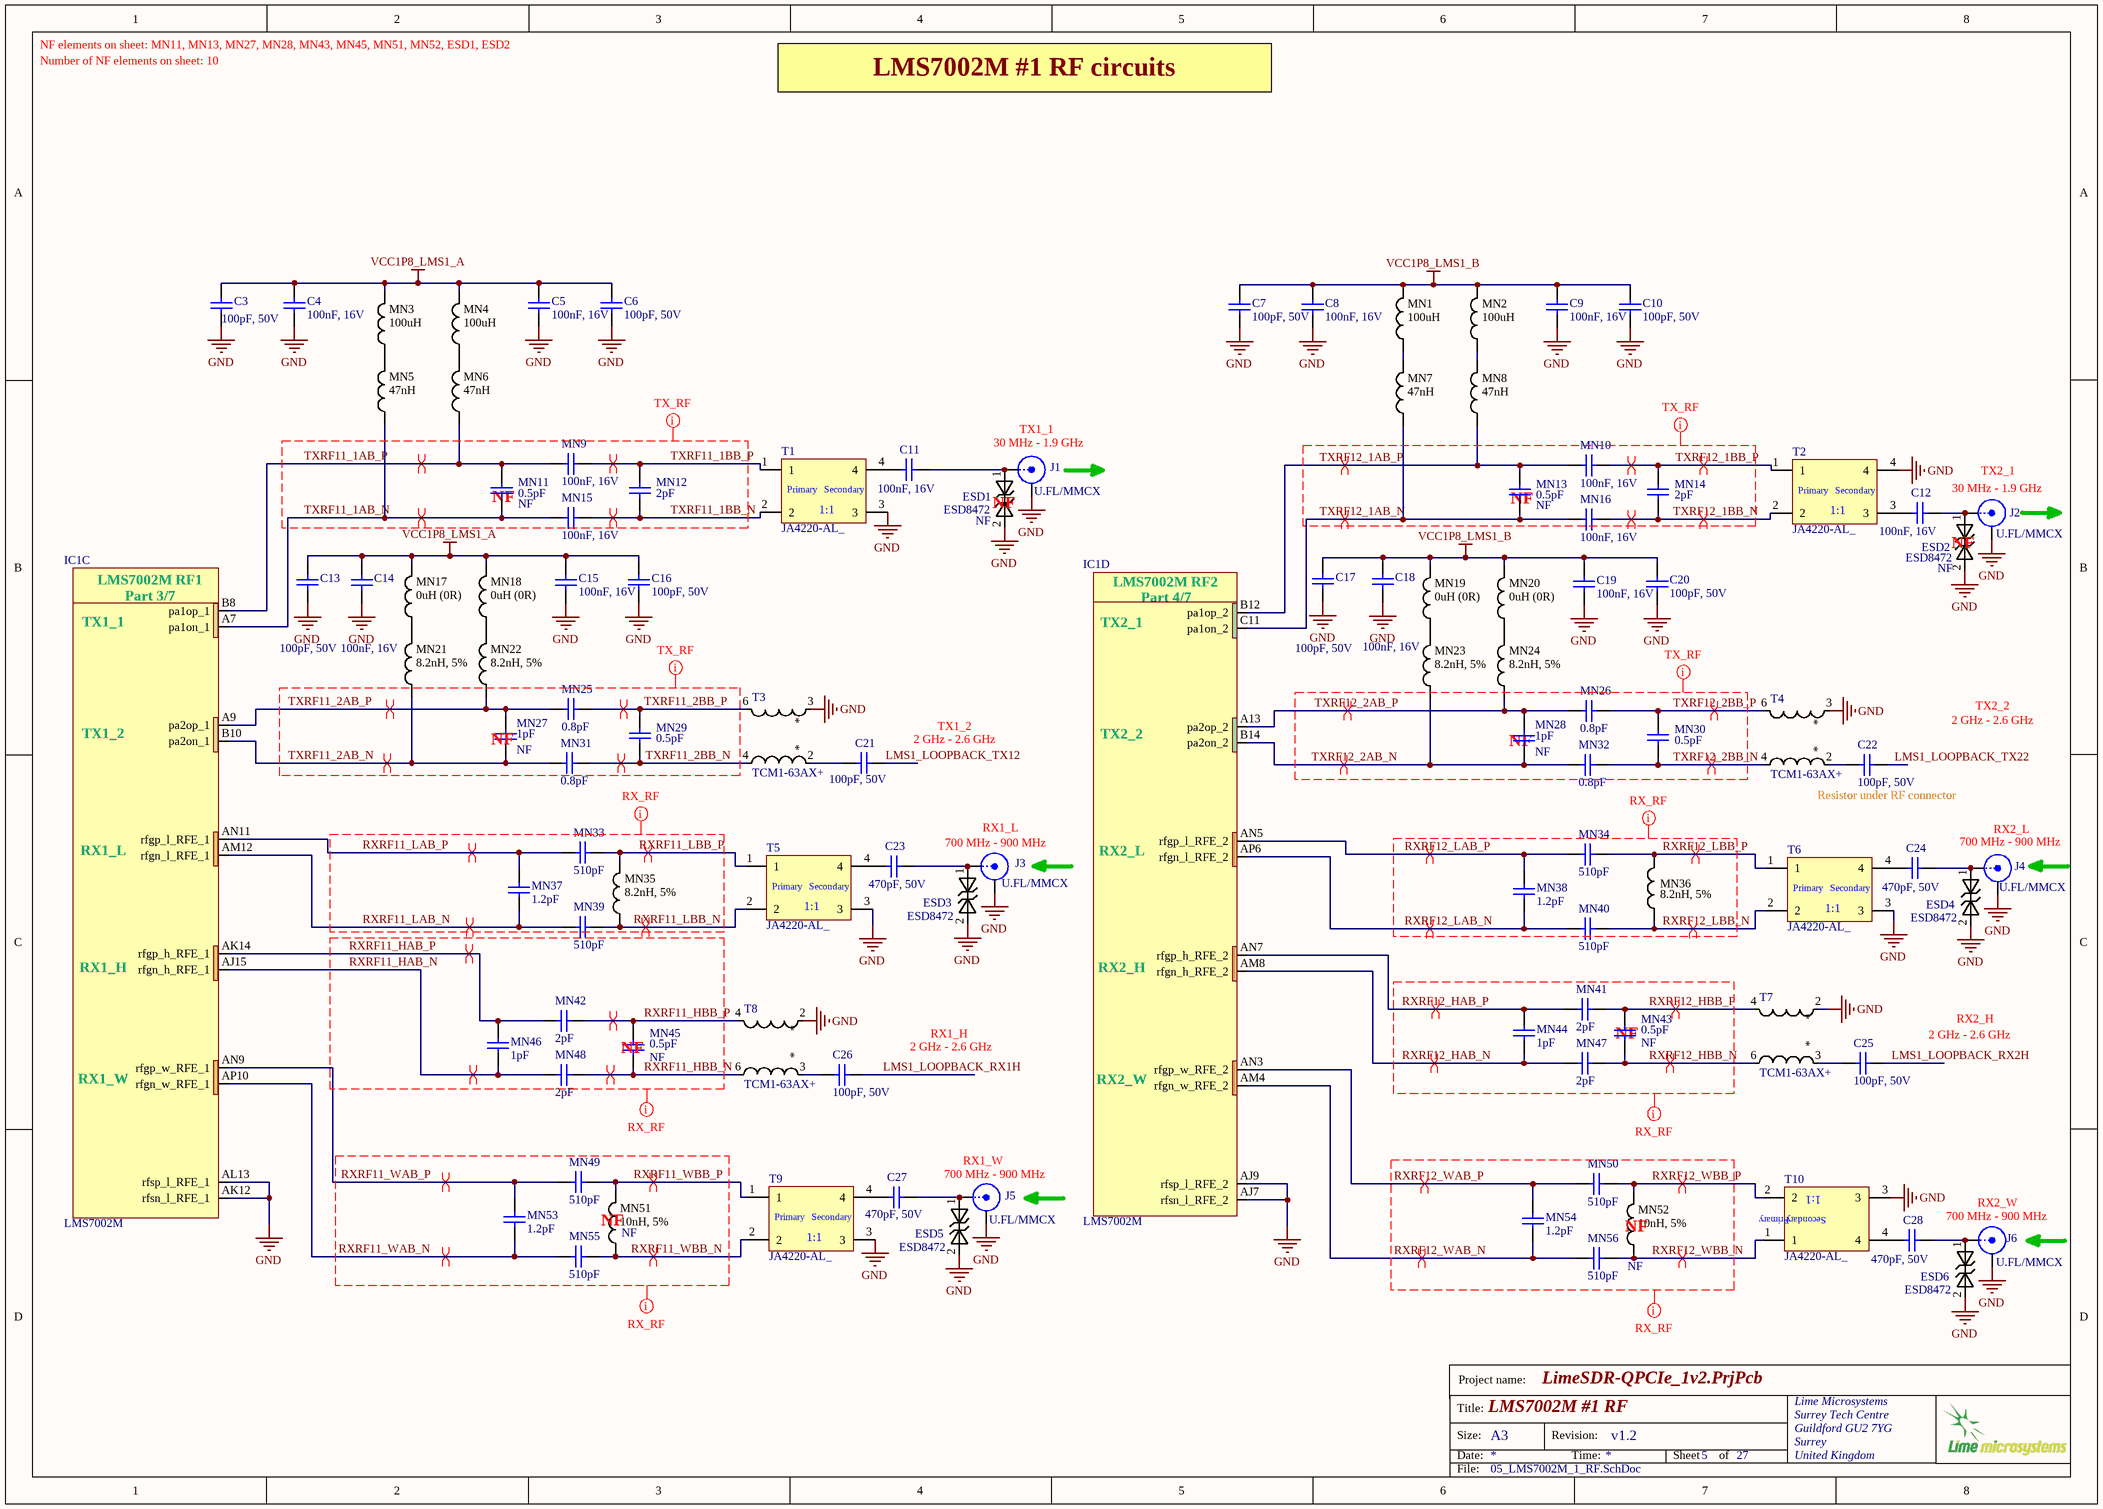
[diagram p4: 05_LMS7002M_1_RF.SchDoc]

### Parts
C3  100pF, 50V  [CAP0402]
C4  100nF, 16V  [CAP0402]
C5  100nF, 16V  [CAP0402]
C6  100pF, 50V  [CAP0402]
C7  100pF, 50V  [CAP0402]
C8  100nF, 16V  [CAP0402]
C9  100nF, 16V  [CAP0402]
C10  100pF, 50V  [CAP0402]
C11  100nF, 16V  [CAP0402]
C12  100nF, 16V  [CAP0402]
C13  100pF, 50V  [CAP0402]
C14  100nF, 16V  [CAP0402]
C15  100nF, 16V  [CAP0402]
C16  100pF, 50V  [CAP0402]
C17  100pF, 50V  [CAP0402]
C18  100nF, 16V  [CAP0402]
C19  100nF, 16V  [CAP0402]
C20  100pF, 50V  [CAP0402]
C21  100pF, 50V  [CAP0402]
C22  100pF, 50V  [CAP0402]
C23  470pF, 50V  [CAP0402]
C24  470pF, 50V  [CAP0402]
C25  100pF, 50V  [CAP0402]
C26  100pF, 50V  [CAP0402]
C27  470pF, 50V  [CAP0402]
C28  470pF, 50V  [CAP0402]
ESD1  ESD8472  Assembly Info: NF  [ESD8472_X3DFN2]
ESD2  ESD8472  Assembly Info: NF  [ESD8472_X3DFN2]
ESD3  ESD8472  [ESD8472_X3DFN2]
ESD4  ESD8472  [ESD8472_X3DFN2]
ESD5  ESD8472  [ESD8472_X3DFN2]
ESD6  ESD8472  [ESD8472_X3DFN2]
IC1  LMS7002M  [LMS7002M_v4]  (parts C,D of 7)
J1  U.FL/MMCX  [MMCX_UFL_conn_u]
J2  U.FL/MMCX  [MMCX_UFL_conn_u]
J3  U.FL/MMCX  [MMCX_UFL_conn_u]
J4  U.FL/MMCX  [MMCX_UFL_conn_u]
J5  U.FL/MMCX  [MMCX_UFL_conn_u]
J6  U.FL/MMCX  [MMCX_UFL_conn_u]
MN1  100uH  [RES0805]
MN2  100uH  [RES0805]
MN3  100uH  [RES0805]
MN4  100uH  [RES0805]
MN5  47nH  [RES0402]
MN6  47nH  [RES0402]
MN7  47nH  [RES0402]
MN8  47nH  [RES0402]
MN9  100nF, 16V  [CAP0402]
MN10  100nF, 16V  [CAP0402]
MN11  0.5pF  Assembly Info: NF  [CAP0402]
MN12  2pF  [CAP0402]
MN13  0.5pF  Assembly Info: NF  [CAP0402]
MN14  2pF  [CAP0402]
MN15  100nF, 16V  [CAP0402]
MN16  100nF, 16V  [CAP0402]
MN17  0uH (0R)  [RES0805]
MN18  0uH (0R)  [RES0805]
MN19  0uH (0R)  [RES0805]
MN20  0uH (0R)  [RES0805]
MN21  8.2nH, 5%  [RES0402]
MN22  8.2nH, 5%  [RES0402]
MN23  8.2nH, 5%  [RES0402]
MN24  8.2nH, 5%  [RES0402]
MN25  0.8pF  [CAP0402]
MN26  0.8pF  [CAP0402]
MN27  1pF  Assembly Info: NF  [CAP0402]
MN28  1pF  Assembly Info: NF  [CAP0402]
MN29  0.5pF  [CAP0402]
MN30  0.5pF  [CAP0402]
MN31  0.8pF  [CAP0402]
MN32  0.8pF  [CAP0402]
MN33  510pF  [CAP0402]
MN34  510pF  [CAP0402]
MN35  8.2nH, 5%  [RES0402]
MN36  8.2nH, 5%  [RES0402]
MN37  1.2pF  [CAP0402]
MN38  1.2pF  [CAP0402]
MN39  510pF  [CAP0402]
MN40  510pF  [CAP0402]
MN41  2pF  [CAP0402]
MN42  2pF  [CAP0402]
MN43  0.5pF  Assembly Info: NF  [CAP0402]
MN44  1pF  [CAP0402]
MN45  0.5pF  Assembly Info: NF  [CAP0402]
MN46  1pF  [CAP0402]
MN47  2pF  [CAP0402]
MN48  2pF  [CAP0402]
MN49  510pF  [CAP0402]
MN50  510pF  [CAP0402]
MN51  10nH, 5%  Assembly Info: NF  [RES0402]
MN52  10nH, 5%  Assembly Info: NF  [RES0402]
MN53  1.2pF  [CAP0402]
MN54  1.2pF  [CAP0402]
MN55  510pF  [CAP0402]
MN56  510pF  [CAP0402]
T1  JA4220-AL_  [JA4220-AL_]
T2  JA4220-AL_  [JA4220-AL_]
T3  TCM1-63AX+  [TCM1-63AX+_v2]
T4  TCM1-63AX+  [TCM1-63AX+_v2]
T5  JA4220-AL_  [JA4220-AL_]
T6  JA4220-AL_  [JA4220-AL_]
T7  TCM1-63AX+  [TCM1-63AX+_v2]
T8  TCM1-63AX+  [TCM1-63AX+_v2]
T9  JA4220-AL_  [JA4220-AL_]
T10  JA4220-AL_  [JA4220-AL_]

### Nets
GND: C3.2 C4.1 C5.1 C6.2 C7.2 C8.1 C9.1 C10.2 C13.2 C14.1 C15.1 C16.2 C17.2 C18.1 C19.1 C20.2 ESD1.2 ESD2.2 ESD3.2 ESD4.2 ESD5.2 ESD6.2 IC1.AJ7(rfsn_l_RFE_2) IC1.AJ9(rfsp_l_RFE_2) IC1.AK12(rfsn_l_RFE_1) IC1.AL13(rfsp_l_RFE_1) J1.2(Y) J2.2(Y) J3.2(Y) J4.2(Y) J5.2(Y) J6.2(Y) T1.3 T2.4 T3.3 T4.3 T5.3 T6.3 T7.2 T8.2 T9.3 T10.3
VCC1P8_LMS1_A: C3.1 C4.2 C5.2 C6.1 C13.1 C14.2 C15.2 C16.1 MN3.2 MN4.2 MN17.2 MN18.2
VCC1P8_LMS1_B: C7.1 C8.2 C9.2 C10.1 C17.1 C18.2 C19.2 C20.1 MN1.2 MN2.2 MN19.2 MN20.2
LMS1_LOOPBACK_RX1H: C26.1
LMS1_LOOPBACK_RX2H: C25.1
LMS1_LOOPBACK_TX12: C21.1
LMS1_LOOPBACK_TX22: C22.1
RXRF11_HAB_N: IC1.AJ15(rfgn_h_RFE_1) MN46.1 MN48.2
RXRF11_HAB_P: IC1.AK14(rfgp_h_RFE_1) MN42.2 MN46.2
RXRF11_HBB_N: MN45.1 MN48.1 T8.6
RXRF11_HBB_P: MN42.1 MN45.2 T8.4
RXRF11_LAB_N: IC1.AM12(rfgn_l_RFE_1) MN37.1 MN39.2
RXRF11_LAB_P: IC1.AN11(rfgp_l_RFE_1) MN33.2 MN37.2
RXRF11_LBB_N: MN35.1 MN39.1 T5.2
RXRF11_LBB_P: MN33.1 MN35.2 T5.1
RXRF11_WAB_N: IC1.AP10(rfgn_w_RFE_1) MN53.2 MN55.2
RXRF11_WAB_P: IC1.AN9(rfgp_w_RFE_1) MN49.2 MN53.1
RXRF11_WBB_N: MN51.1 MN55.1 T9.2
RXRF11_WBB_P: MN49.1 MN51.2 T9.1
RXRF12_HAB_N: IC1.AM8(rfgn_h_RFE_2) MN44.1 MN47.2
RXRF12_HAB_P: IC1.AN7(rfgp_h_RFE_2) MN41.2 MN44.2
RXRF12_HBB_N: MN43.1 MN47.1 T7.6
RXRF12_HBB_P: MN41.1 MN43.2 T7.4
RXRF12_LAB_N: IC1.AP6(rfgn_l_RFE_2) MN38.1 MN40.2
RXRF12_LAB_P: IC1.AN5(rfgp_l_RFE_2) MN34.2 MN38.2
RXRF12_LBB_N: MN36.1 MN40.1 T6.2
RXRF12_LBB_P: MN34.1 MN36.2 T6.1
RXRF12_WAB_N: IC1.AM4(rfgn_w_RFE_2) MN54.2 MN56.2
RXRF12_WAB_P: IC1.AN3(rfgp_w_RFE_2) MN50.2 MN54.1
RXRF12_WBB_N: MN52.1 MN56.1 T10.1
RXRF12_WBB_P: MN50.1 MN52.2 T10.2
TXRF11_1AB_N: IC1.A7(pa1on_1) MN5.1 MN11.1 MN15.1
TXRF11_1AB_P: IC1.B8(pa1op_1) MN6.1 MN9.2 MN11.2
TXRF11_1BB_N: MN12.1 MN15.2 T1.2
TXRF11_1BB_P: MN9.1 MN12.2 T1.1
TXRF11_2AB_N: IC1.B10(pa2on_1) MN21.1 MN27.2 MN31.2
TXRF11_2AB_P: IC1.A9(pa2op_1) MN22.1 MN25.2 MN27.1
TXRF11_2BB_N: MN29.1 MN31.1 T3.4
TXRF11_2BB_P: MN25.1 MN29.2 T3.6
TXRF12_1AB_N: IC1.C11(pa1on_2) MN7.1 MN13.1 MN16.1
TXRF12_1AB_P: IC1.B12(pa1op_2) MN8.1 MN10.2 MN13.2
TXRF12_1BB_N: MN14.1 MN16.2 T2.2
TXRF12_1BB_P: MN10.1 MN14.2 T2.1
TXRF12_2AB_N: IC1.B14(pa2on_2) MN23.1 MN28.2 MN32.2
TXRF12_2AB_P: IC1.A13(pa2op_2) MN24.1 MN26.2 MN28.1
TXRF12_2BB_N: MN30.1 MN32.1 T4.4
TXRF12_2BB_P: MN26.1 MN30.2 T4.6
NetC11_1: C11.1 ESD1.1 J1.1(X)
NetC11_2: C11.2 T1.4
NetC12_1: C12.1 ESD2.1 J2.1(X)
NetC12_2: C12.2 T2.3
NetC21_2: C21.2 T3.2
NetC22_2: C22.2 T4.2
NetC23_1: C23.1 ESD3.1 J3.1(X)
NetC23_2: C23.2 T5.4
NetC24_1: C24.1 ESD4.1 J4.1(X)
NetC24_2: C24.2 T6.4
NetC25_2: C25.2 T7.3
NetC26_2: C26.2 T8.3
NetC27_1: C27.1 ESD5.1 J5.1(X)
NetC27_2: C27.2 T9.4
NetC28_1: C28.1 ESD6.1 J6.1(X)
NetC28_2: C28.2 T10.4
NetMN1_1: MN1.1 MN7.2
NetMN2_1: MN2.1 MN8.2
NetMN3_1: MN3.1 MN5.2
NetMN4_1: MN4.1 MN6.2
NetMN17_1: MN17.1 MN21.2
NetMN18_1: MN18.1 MN22.2
NetMN19_1: MN19.1 MN23.2
NetMN20_1: MN20.1 MN24.2

### Layout directives
differential pair: RXRF11_HAB_N, RXRF11_HAB_P, RXRF11_HBB_N, RXRF11_HBB_P, RXRF11_LAB_N, RXRF11_LAB_P, RXRF11_LBB_N, RXRF11_LBB_P, RXRF11_WAB_N, RXRF11_WAB_P, RXRF11_WBB_N, RXRF11_WBB_P, RXRF12_HAB_N, RXRF12_HAB_P, RXRF12_HBB_N, RXRF12_HBB_P, RXRF12_LAB_N, RXRF12_LAB_P, RXRF12_LBB_N, RXRF12_LBB_P, RXRF12_WAB_N, RXRF12_WAB_P, RXRF12_WBB_N, RXRF12_WBB_P, TXRF11_1AB_N, TXRF11_1AB_P, TXRF11_1BB_N, TXRF11_1BB_P, TXRF11_2AB_N, TXRF11_2AB_P, TXRF11_2BB_N, TXRF11_2BB_P, TXRF12_1AB_N, TXRF12_1AB_P, TXRF12_1BB_N, TXRF12_1BB_P, TXRF12_2AB_N, TXRF12_2AB_P, TXRF12_2BB_N, TXRF12_2BB_P
net class TX_RF: TXRF11_1AB_N, TXRF11_1AB_P, TXRF11_1BB_N, TXRF11_1BB_P, TXRF11_2AB_N, TXRF11_2AB_P, TXRF11_2BB_N, TXRF11_2BB_P, TXRF12_1AB_N, TXRF12_1AB_P, TXRF12_1BB_N, TXRF12_1BB_P, TXRF12_2AB_N, TXRF12_2AB_P, TXRF12_2BB_N, TXRF12_2BB_P
net class RX_RF: RXRF11_HAB_N, RXRF11_HAB_P, RXRF11_HBB_N, RXRF11_HBB_P, RXRF11_LAB_N, RXRF11_LAB_P, RXRF11_LBB_N, RXRF11_LBB_P, RXRF11_WAB_N, RXRF11_WAB_P, RXRF11_WBB_N, RXRF11_WBB_P, RXRF12_HAB_N, RXRF12_HAB_P, RXRF12_HBB_N, RXRF12_HBB_P, RXRF12_LAB_N, RXRF12_LAB_P, RXRF12_LBB_N, RXRF12_LBB_P, RXRF12_WAB_N, RXRF12_WAB_P, RXRF12_WBB_N, RXRF12_WBB_P

### Notes on the sheet
- Number of NF elements on sheet: 10
- NF elements on sheet: MN11, MN13, MN27, MN28, MN43, MN45, MN51, MN52, ESD1, ESD2
- LMS7002M #1 RF circuits
- 30 MHz - 1.9 GHz
- TX1_1
- (near MN11) NF
- (near ESD1) NF
- (near MN13) NF
- TX2_1
- (near ESD2) NF
- TX2_2
- (near MN27) NF
- (near C21) 2 GHz - 2.6 GHz
- TX1_2
- (near MN28) NF
- 2 GHz - 2.6 GHz
- 700 MHz - 900 MHz
- RX1_L
- Resistor under RF connector
- RX2_L
- (near MN45) NF
- RX1_H
- (near MN43) NF
- RX2_H
- RX1_W
- (near MN51) NF
- (near MN52) NF
- RX2_W
- Project name:
- Title:
- Size:
- Date:
- A3
- Revision:
- Time:
- Sheet
- of
- File:
- (in symbol JA4220-AL_) Primary; Secondary; 1:1
- (in symbol LMS7002Mr3, part C) LMS7002M RF1; Part 3/7; TX1_1; TX1_2; RX1_L; RX1_H; RX1_W
- (in symbol LMS7002Mr3, part D) LMS7002M RF2; Part 4/7; TX2_1; TX2_2; RX2_L; RX2_H; RX2_W

### Library data of the parts
C3 C6 C7 C10 C13 C16 C17 C20 = Cap_0402: Manufacturer: Yageo; Manufacturer Part Number 1: CC0402JRNPO9BN101; Part Description: 100pF ±5% 50V C0G, NP0 Ceramic Capacitor -55°C ~ 125°C Surface Mount, MLCC 0402 (1005 Metric) 0.039" L x 0.020" W (1.00mm x 0.50mm); Temperature Coefficient: C0G, NP0; Tolerance: ±5%; Value: 100pF, 50V; Supplier 1: Digi-Key; Supplier Part Number 1: 311-1024-1-ND; Category: Capacitors; Features: -; Operating Temperature: -55°C ~ 125°C; Capacitance: 100pF; Thickness (Max): 0.022" (0.55mm); RoHS: RoHS Compliant; Voltage - Rated: 50V; Lead Style: -; Ratings: -; Size / Dimension: 0.039" L x 0.020" W (1.00mm x 0.50mm); Height - Seated (Max): -; Applications: General Purpose; Package / Case: 0402 (1005 Metric); Lead Spacing: -; Packaging: Tape & Reel (TR); Mounting Type: Surface Mount, MLCC
C4 C5 C8 C9 C11 C12 C14 C15 C18 C19 = Cap_0402: Manufacturer: Murata Electronics; Manufacturer Part Number: GRM155R71C104KA88D; Part Description: 0.10µF ±10% 16V Ceramic Capacitor X7R 0402 (1005 Metric); Tolerance: 10 %; Type: General Purpose MLCC; Capacitance: 0.1 uF; Case Length: 1 mm; Dielectric: X7R; Case Height: 0.5 mm; Temperature Coefficient / Code: +/- 15 %; Value: 100nF, 16V; Supplier 1: Mouser; Supplier Part Number 1: 81-GRM155R71C104KA88; Case Code - in: 0402; RoHS: RoHS Compliant; Operating Temperature Range: - 55 C to + 125 C; Series: GRM; Termination Style: SMD/SMT; Package / Case: 0402 (1005 metric); Voltage Rating DC: 16 V; Maximum Operating Temperature: + 125 C; Case Code - mm: 1005; Minimum Operating Temperature: - 55 C; Product Category: Low & Medium Capacitance SMD Ceramic Chip Capacitors; Packaging: Reel; Product: General Type MLCCs; Category: Multilayer Ceramic Capacitors MLCC - SMD/SMT; Brand: Murata Electronics; Case Width: 0.5 mm; RoHS - Mouser: Y; Standard Pack Qty: 10000; Minimum Order Quantity: 1; Reeling: True; Manufacturer Part Number 1: GRM155R71C104KA88D
C21 C22 C25 C26 = Cap_0402: Manufacturer Part Number 1: CC0402JRNPO9BN101; Manufacturer: Yageo; Part Description: 100pF ±5% 50V C0G, NP0 Ceramic Capacitor -55°C ~ 125°C Surface Mount, MLCC 0402 (1005 Metric) 0.039" L x 0.020" W (1.00mm x 0.50mm); Tolerance: ±5%; Temperature Coefficient: C0G, NP0; Value: 100pF, 50V; Capacitance: 100pF; Thickness (Max): 0.022" (0.55mm); Size / Dimension: 0.039" L x 0.020" W (1.00mm x 0.50mm); RoHS: RoHS Compliant; Ratings: -; Package / Case: 0402 (1005 Metric); Mounting Type: Surface Mount, MLCC; Height - Seated (Max): -; Features: -; Lead Spacing: -; Voltage - Rated: 50V; Operating Temperature: -55°C ~ 125°C; Packaging: Cut Tape (CT); Applications: General Purpose; Lead Style: -; Supplier 1: Digi-Key; Category: Capacitors; Supplier Part Number 1: 311-1024-1-ND
C23 C24 C27 C28 = Cap_0402: Manufacturer Part Number: C1005C0G1H471J050BA; Manufacturer: TDK Corporation; Part Description: 470pF ±5% 50V Ceramic Capacitor C0G, NP0 0402 (1005 Metric); Tolerance: ±5%; Temperature Coefficient: C0G, NP0; Value: 470pF, 50V; Supplier 1: Digi-Key; Supplier Part Number 1: 445-2656-6-ND; Ratings: -; Package / Case: 0402 (1005 Metric); Capacitance: 470pF; Packaging: Digi-Reel®; RoHS: RoHS Compliant; Lead Style: -; Thickness (Max): 0.022" (0.55mm); Size / Dimension: 0.039" L x 0.020" W (1.00mm x 0.50mm); Lead Spacing: -; Operating Temperature: -55°C ~ 125°C; Height - Seated (Max): -; Applications: General Purpose; Mounting Type: Surface Mount, MLCC; Voltage - Rated: 50V; Category: Capacitors; Features: -
ESD1-ESD6 = ESD8472: Manufacturer: ON Semiconductor; Manufacturer Part Number: ESD8472MUT5G; Part Description: TVS DIODE 5.3VWM 14VC X3DFN2; Voltage - Reverse Standoff (Typ): 5.3V (Max); Voltage - Breakdown (Min): 7V; Voltage - Clamping (Max) @ Ipp: 14V; Current - Peak Pulse (10/1000µs): 3A (8/20µs); Power Line Protection: No; Capacitance @ Frequency: 0.2pF @ 1MHz; Supplier 1: Digi-Key; RoHS: RoHS Compliant; Category: Circuit Protection; Stock 1: 2295; Pricing 1: 1=0.39, 10=0.315, 100=0.2142, 500=0.16068, 1000=0.12051 (USD); Packaging: Cut Tape (CT); Part Status: Active; Type: Zener; Power - Peak Pulse: -; Applications: Automotive, RF Antenna; Operating Temperature: -55°C ~ 150°C (TJ); Mounting Type: Surface Mount; Package / Case: 2-XFDFN; Supplier Device Package: 2-X3DFN (0.62x0.32); ComponentLink1URL: http://www.onsemi.com/pub/Collateral/ESD8472-D.PDF; ComponentLink1Description: http://www.onsemi.com/pub/Collateral/ESD8472-D.PDF; Supplier Part Number 1: ESD8472MUT5GOSCT-ND
IC1 = LMS7002Mr3: as IC1 on sheet 04_LMS7002M_Digital; Supplier 1: Lime Microsystems; Supplier Part Number 1: LMS7002M; Manufacturer Part Number 1: LMS7002M
J1-J6 = RF_IF_connector: CONN UMC RCPT STR 50 OHM SMD; Manufacturer: Molex, LLC; Manufacturer Part Number 1: 0734120110; Part Description: Ultra Miniature Coaxial Connector Receptacle, Male Pin 50 Ohm Surface Mount Solder; Body Finish: Nickel; Body Material: Phosphor Bronze; Center Contact Material: Brass; Center Contact Plating: Gold; Connector Style: Ultra Miniature Coaxial; Connector Type: Jack, Male Pin; Contact Termination: Solder; Dielectric Material: Liquid Crystal Polymer (LCP); Frequency - Max: 6GHz; Impedance: 50 Ohm; Voltage Rating: 60V; Cable Group: -; Category: Connectors, Interconnects; Fastening Type: Snap-On; Features: -; Housing Color: Silver; Ingress Protection: -; Mounting Type: Surface Mount; Operating Temperature: -40°C ~ 90°C; Packaging: Cut Tape (CT); RoHS: RoHS Compliant; Shield Termination: Solder; Supplier 1: Digi-Key; Supplier Part Number 1: WM5587CT-ND
MN1-MN4 = Inductor_0603: Manufacturer: TDK Corporation; Manufacturer Part Number: MLF2012C101KT000; Part Description: 100µH Shielded Multilayer Inductor 2mA 3.1 Ohm Max 0805 (2012 Metric); Q @ Freq: 25 @ 1MHz; Shielding: Shielded; Current Rating: 2mA; Frequency - Self Resonant: 7MHz; Frequency - Test: 1MHz; Material - Core: Ferrite; Tolerance: ±10%; Inductance: 100µH; DC Resistance (DCR): 3.1 Ohm Max; Value: 100uH; Supplier 1: Digi-Key; Supplier Part Number 1: 445-1071-1-ND; Supplier Device Package: 0805 (2012 Metric); Size / Dimension: 0.079" L x 0.049" W (2.00mm x 1.25mm); Operating Temperature: -40°C ~ 85°C; Packaging: Cut Tape (CT); RoHS: RoHS Compliant; Current - Saturation: -; Height - Seated (Max): 0.057" (1.45mm); Package / Case: 0805 (2012 Metric); Mounting Type: Surface Mount; Type: Multilayer; Category: Inductors, Coils, Chokes
MN5-MN8 = Inductor_0603: Manufacturer: COILCRAFT; Manufacturer Part Number: 0402HP-47NXJLU; Part Description: COILCRAFT  0402HP-47NXJLU  Surface Mount High Frequency Inductor, 0402HP Series, 47 nH, 420 mA, 0402 [1005 Metric], Wirewound; SVHC: No SVHC (15-Jun-2015); Inductance Tolerance: ± 5%; High Frequency Inductor Case: 0402 [1005 Metric]; Inductor Case Style: 0402 [1005 Metric]<!--FANDB--><div class="features-and-benefits-container"></div>; Inductance: 47; DC Resistance Max: 0.58; Self Resonant Frequency Min: 2.4; Product Range: 0402; DC Current Rating: 420; Inductor Construction: Wirewound; Supplier 1: Farnell; Supplier Part Number 1: 2285856; Packaging: Cut Tape; RoHS: Y-EX; value: 47nH; Manufacturer Part Number 1: 0402HP-47NXJLU
MN9 MN10 MN15 MN16 = Cap_0402: Manufacturer: Murata Electronics; Manufacturer Part Number: GRM155R71C104KA88D; Part Description: 0.10µF ±10% 16V Ceramic Capacitor X7R 0402 (1005 Metric); Tolerance: 10 %; Capacitance: 0.1 uF; Case Length: 1 mm; Dielectric: X7R; Case Height: 0.5 mm; Temperature Coefficient / Code: +/- 15 %; Value: 100nF, 16V; Supplier 1: Mouser; Supplier Part Number 1: 81-GRM155R71C104KA88; Case Code - in: 0402; RoHS: RoHS Compliant; Operating Temperature Range: - 55 C to + 125 C; Series: GRM; Termination Style: SMD/SMT; Package / Case: 0402 (1005 metric); Voltage Rating DC: 16 V; Type: General Purpose MLCC; Maximum Operating Temperature: + 125 C; Case Code - mm: 1005; Minimum Operating Temperature: - 55 C; Product Category: Low & Medium Capacitance SMD Ceramic Chip Capacitors; Packaging: Reel; Product: General Type MLCCs; Category: Multilayer Ceramic Capacitors MLCC - SMD/SMT; Brand: Murata Electronics; Case Width: 0.5 mm; RoHS - Mouser: Y; Standard Pack Qty: 10000; Minimum Order Quantity: 1; Reeling: True; Manufacturer Part Number 1: GRM155R71C104KA88D
MN11 MN13 MN29 MN30 MN43 MN45 = Cap_0402: Manufacturer: Yageo; Manufacturer Part Number 1: CC0402CRNPO9BNR50; Part Description: 0.50pF ±0.25pF 50V Ceramic Capacitor C0G, NP0 0402 (1005 Metric); Capacitance: 0.50pF; Voltage - Rated: 50V; Temperature Coefficient: C0G, NP0; Tolerance: ±0.25pF; Value: 0.5pF; Supplier 1: Digi-Key; Supplier Part Number 1: 311-1001-1-ND; RoHS: RoHS Compliant; Thickness (Max): 0.022" (0.55mm); Features: -; Height - Seated (Max): -; Lead Spacing: -; Applications: General Purpose; Packaging: Cut Tape (CT); Ratings: -; Size / Dimension: 0.039" L x 0.020" W (1.00mm x 0.50mm); Lead Style: -; Mounting Type: Surface Mount, MLCC; Operating Temperature: -55°C ~ 125°C; Package / Case: 0402 (1005 Metric); Category: Capacitors
MN12 MN14 MN41 MN42 MN47 MN48 = Cap_0402: Manufacturer: AVX; Manufacturer Part Number 1: 04025U2R0BAT2A; Part Description: 2pF ±0.1pF 50V Ceramic Capacitor C0G, NP0 0402 (1005 Metric); Product Range: U Series; Voltage Rating: 50; SVHC: No SVHC (17-Dec-2014); Capacitance Tolerance: ± 0.1; Ceramic Capacitor Case: 0402 [1005 Metric]; Capacitance: 2; Dielectric Characteristic: C0G / NP0; Value: 2pF; Supplier 1: Farnell; Supplier Part Number 1: 2332536; Operating Temperature Max: 125; RoHS: YES; Operating Temperature Min: -55; Capacitance Tolerance ±: ± 0.1; Packaging: Cut Tape; MSL: MSL 1 - Unlimited
MN17-MN20 = Inductor_0603: Manufacturer: BOURNS; Manufacturer Part Number 1: CR0805-J/-000ELF; Part Description: RES SMD 0.0 OHM JUMPER 1/8W 0805; Value: 0uH (0R); Supplier 1: Farnell; Supplier Part Number 1: 2008388; RoHS: YES
MN21-MN24 MN35 MN36 = Inductor_0603: Manufacturer: COILCRAFT; Manufacturer Part Number 1: 0402HP-8N2XJLU; Part Description: Surface Mount High Frequency Inductor, 0402HP Series, 8.2 nH, 1.5 A, 0402 [1005 Metric], Wirewound; Inductor Construction: Wirewound; DC Current Rating: 1.5; Inductor Case Style: 0402 [1005 Metric]<!--FANDB--><div class="features-and-benefits-container"></div>; Self Resonant Frequency Min: 5.4; DC Resistance Max: 0.065; High Frequency Inductor Case: 0402 [1005 Metric]; SVHC: No SVHC (16-Jun-2014); Inductance: 8.2; Supplier 1: Farnell; Supplier Part Number 1: 2285826; Packaging: Cut Tape; Product Range: COILCRAFT - 0402; Inductance Tolerance: ± 5%; RoHS: Y-EX; Value: 8.2nH, 5%
MN25 MN26 MN31 MN32 = Cap_0402: Manufacturer: Murata Electronics North America; Manufacturer Part Number 1: GRM1555C1HR80BA01D; Part Description: 0.80pF ±0.1pF 50V Ceramic Capacitor C0G, NP0 0402 (1005 Metric); Temperature Coefficient: C0G, NP0; Capacitance: 0.80pF; Voltage - Rated: 50V; Tolerance: ±0.1pF; Value: 0.8pF; Applications: General Purpose; Operating Temperature: -55°C ~ 125°C; Size / Dimension: 0.039" L x 0.020" W (1.00mm x 0.50mm); Features: -; Supplier 1: Digi-Key; Height - Seated (Max): -; Category: Capacitors; Package / Case: 0402 (1005 Metric); Mounting Type: Surface Mount, MLCC; Lead Spacing: -; Thickness (Max): 0.022" (0.55mm); RoHS: RoHS Compliant; Supplier Part Number 1: 490-6269-1-ND; Packaging: Cut Tape (CT); Ratings: -; Lead Style: -
MN27 MN28 MN44 MN46 = Cap_0402: Manufacturer: TDK Corporation; Manufacturer Part Number 1: C1005C0G1H010B050BA; Part Description: 1pF ±0.1pF 50V Ceramic Capacitor C0G, NP0 0402 (1005 Metric); Voltage - Rated: 50V; Temperature Coefficient: C0G, NP0; Tolerance: ±0.1pF; Value: 1pF; Supplier 1: Digi-Key; Supplier Part Number 1: 445-4854-6-ND; Size / Dimension: 0.039" L x 0.020" W (1.00mm x 0.50mm); Lead Spacing: -; Operating Temperature: -55°C ~ 125°C; Thickness (Max): 0.022" (0.55mm); Package / Case: 0402 (1005 Metric); Features: -; Lead Style: -; Applications: General Purpose; Height - Seated (Max): -; Capacitance: 1pF; RoHS: RoHS Compliant; Mounting Type: Surface Mount, MLCC; Packaging: Digi-Reel®; Ratings: -; Category: Capacitors
MN33 MN34 MN39 MN40 MN49 MN50 MN55 MN56 = Cap_0402: Manufacturer: Murata Electronics North America; Manufacturer Part Number 1: GRM1555C1H511JA01D; Part Description: 510pF ±5% 50V Ceramic Capacitor C0G, NP0 0402 (1005 Metric); Voltage - Rated: 50V; Temperature Coefficient: C0G, NP0; Tolerance: ±5%; Value: 510pF; Supplier 1: Digi-Key; Supplier Part Number 1: 490-3237-1-ND; Height - Seated (Max): -; Features: -; Size / Dimension: 0.039" L x 0.020" W (1.00mm x 0.50mm); Applications: General Purpose; Lead Spacing: -; Package / Case: 0402 (1005 Metric); Ratings: -; Thickness (Max): 0.022" (0.55mm); Lead Style: -; Operating Temperature: -55°C ~ 125°C; Mounting Type: Surface Mount, MLCC; Capacitance: 510pF; Category: Capacitors; RoHS: RoHS Compliant; Packaging: Cut Tape (CT)
MN37 MN38 MN53 MN54 = Cap_0402: Manufacturer: Murata Electronics North America; Manufacturer Part Number 1: GRM1555C1H1R2CA01D; Part Description: 1.2pF ±0.25pF 50V Ceramic Capacitor C0G, NP0 0402 (1005 Metric); Temperature Coefficient: C0G, NP0; Voltage - Rated: 50V; Tolerance: ±0.25pF; Value: 1.2pF; Supplier 1: Digi-Key; Supplier Part Number 1: 490-5927-1-ND; Lead Style: -; Category: Capacitors; Features: -; Packaging: Cut Tape (CT); Operating Temperature: -55°C ~ 125°C; Package / Case: 0402 (1005 Metric); Applications: General Purpose; Size / Dimension: 0.039" L x 0.020" W (1.00mm x 0.50mm); Lead Spacing: -; Ratings: -; Mounting Type: Surface Mount, MLCC; RoHS: RoHS Compliant; Height - Seated (Max): -; Thickness (Max): 0.022" (0.55mm); Capacitance: 1.2pF
MN51 MN52 = Inductor_0603: Manufacturer: COILCRAFT; Part Description: Surface Mount High Frequency Inductor, 0402HP Series, 10 nH, 1.3 A, 0402 [1005 Metric], Wirewound; Manufacturer Part Number 1: 0402HP-10NXJLU; Value: 10nH, 5%; Supplier 1: Farnell; Supplier Part Number 1: 2285830; RoHS: Y-EX
T1 T2 T5 T6 T9 T10 = JA4220-AL_: Part Description: RF balun; 1:1 ratio; 3 dB bandwidth: 0.1 MHz to 3.5 GHz; 3.8mm x 3.8mm; Manufacturer: Coilcraft; Supplier 1: Coilcraft; Supplier Part Number: JA4220-AL_; Supplier Part Number 1: JA4220-AL_
T3 T4 T7 T8 = Balun_v2: Manufacturer: Mini-circuits; Part Description: BALUN WIDE BAND; Manufacturer Part Number 1: TCM1-63AX+; Supplier 1: Mini-circuits; Supplier Part Number 1: TCM1-63AX+